# EasyEDA Pro project KeysDock.eprj, schematic z.controller-old
Board Name: controller; Create Date: 2025-10-22; Page Name: general; Project Name: KeysDock; Schematic Name: controller; Update Date: 2025-10-24; Company: KeysDock Dev; Drawed: Reverier-Xu; Page Size: A4; Version: V1.0
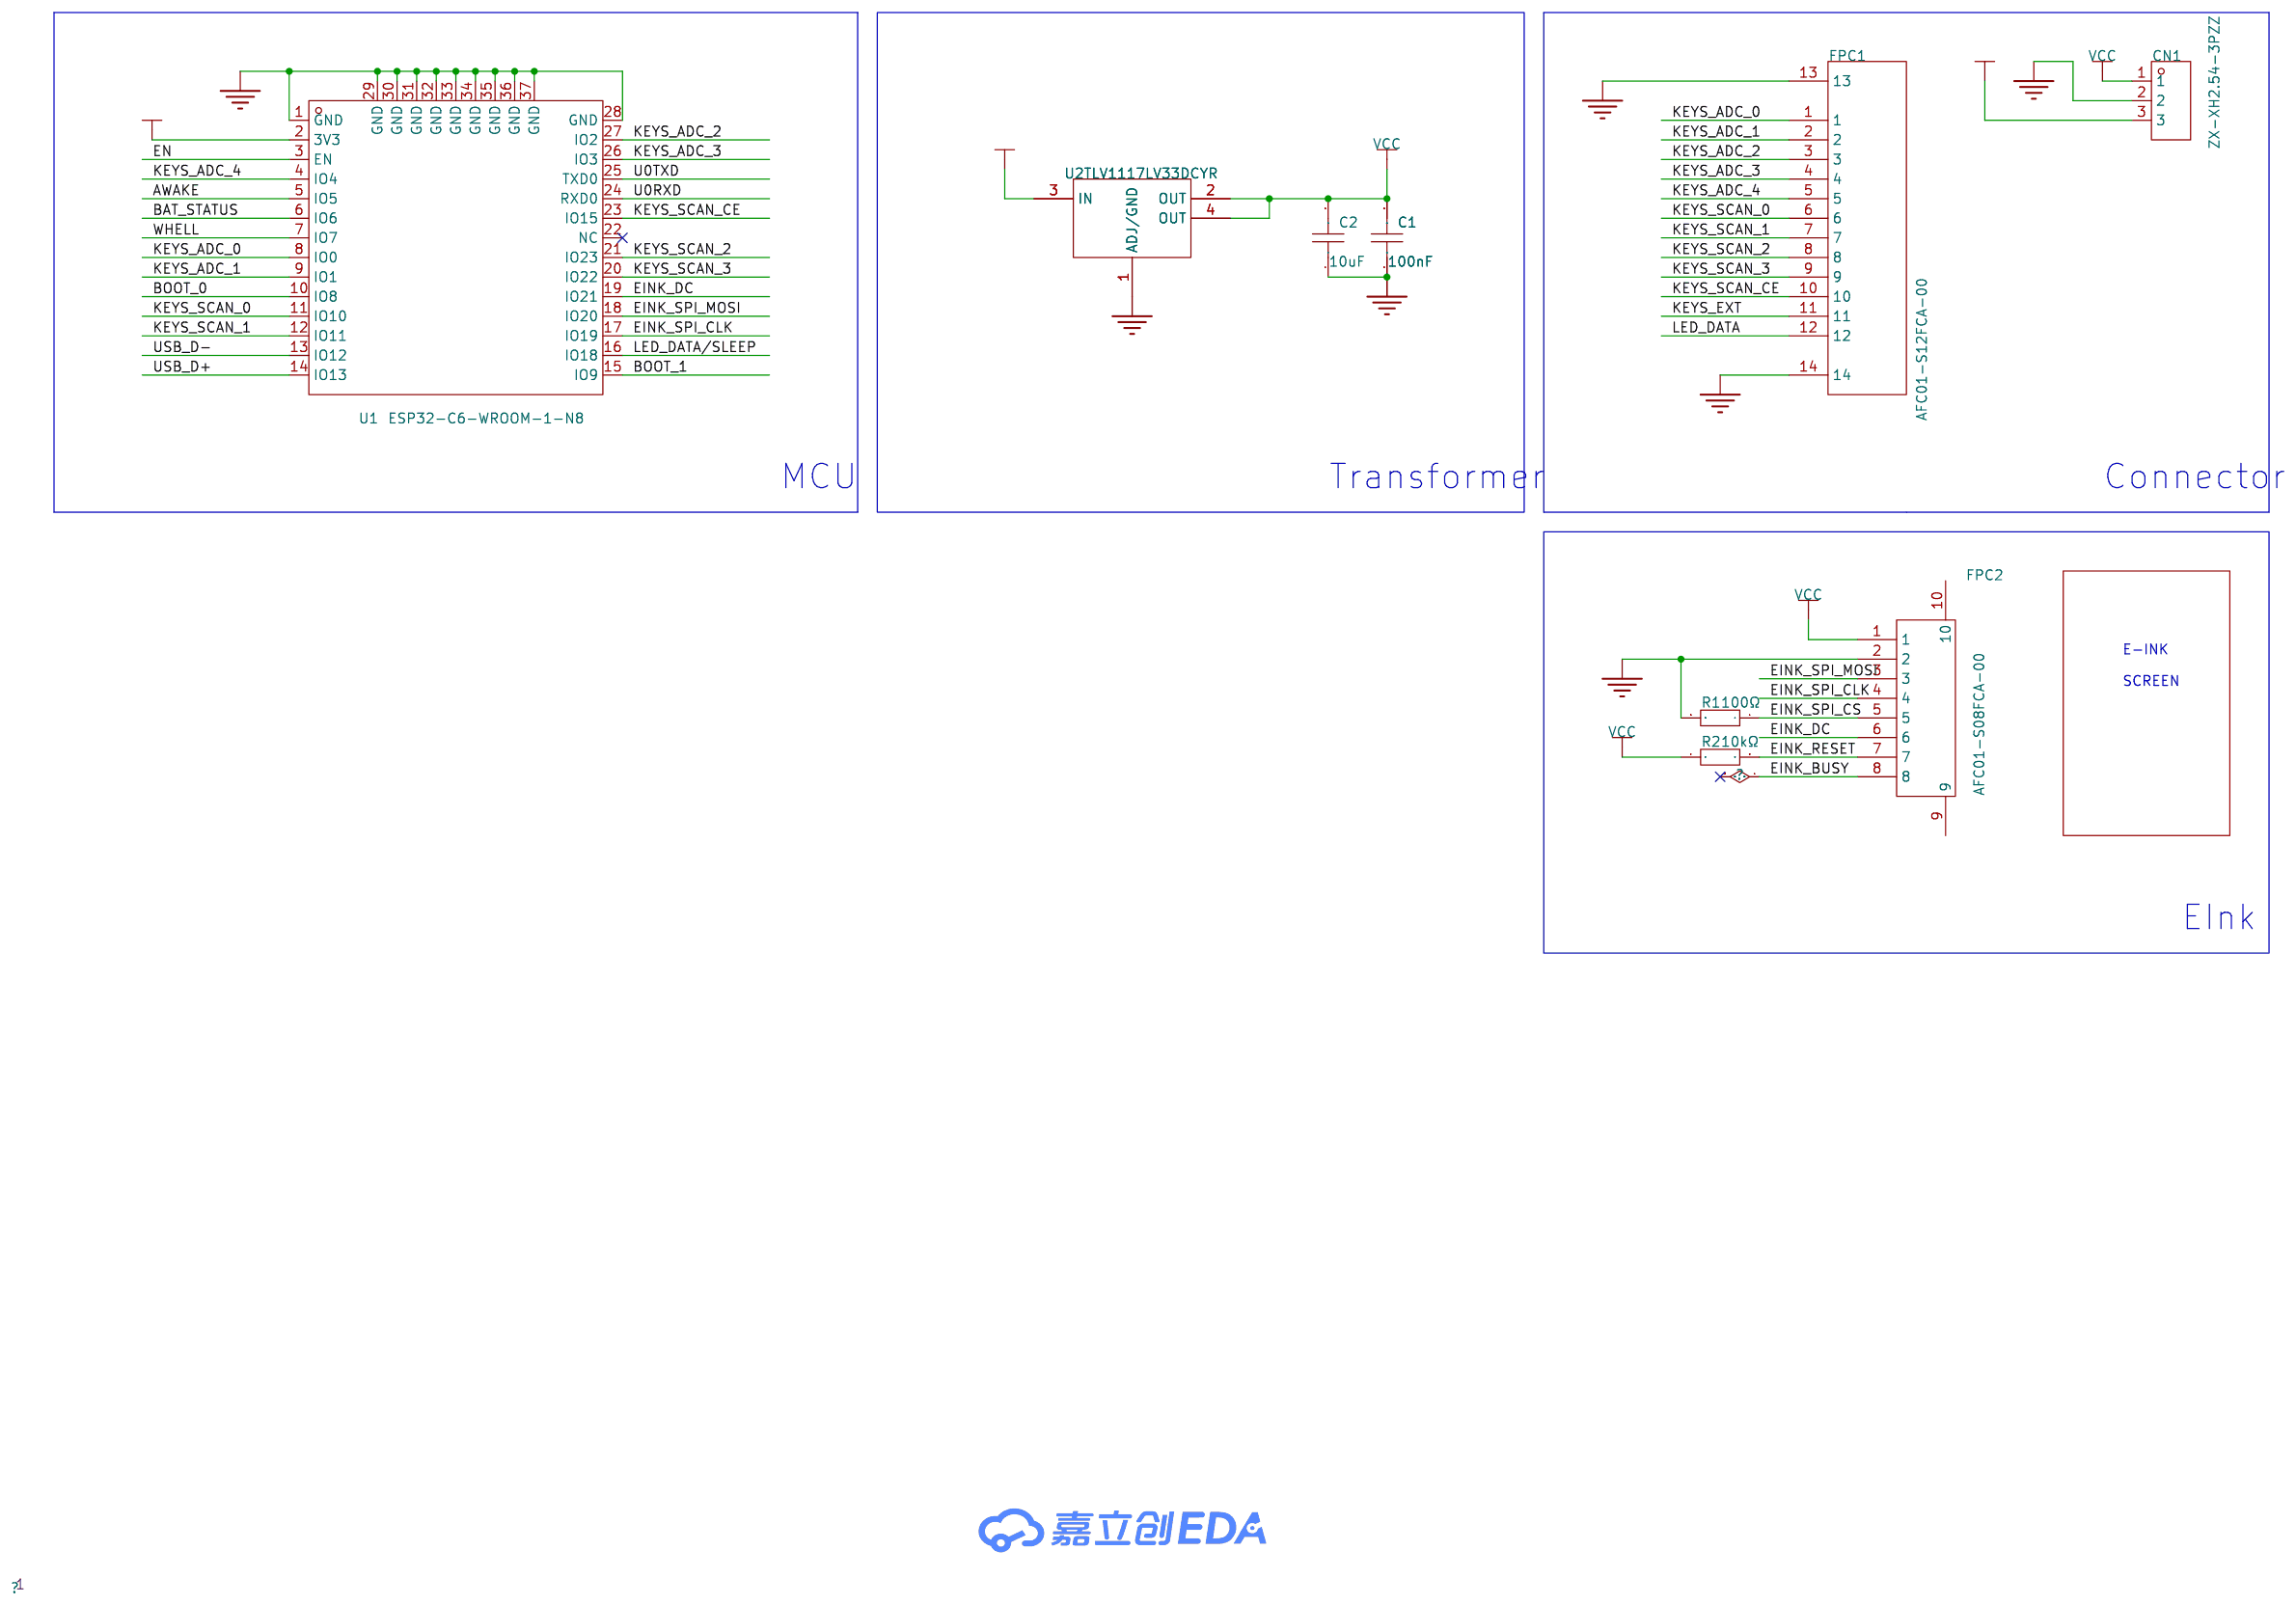
[diagram p8: schematic sheet]

## Parts
C1  100nF  [C0603]
C2  10uF  [C0603]
CN1  ZX-XH2.54-3PZZ  [CONN-TH_3P-P2.54_2501S-3P]
FPC1  AFC01-S12FCA-00  [FPC-SMD_AFC01-S12FCA-00]
FPC2  AFC01-S08FCA-00  [FPC-SMD_P0.50-8P_FGS-XJ-H2.0]
R1  100Ω  [R0402]
R2  10kΩ  [R0402]
U1  ESP32-C6-WROOM-1-N8  [WIRELM-SMD_ESP32-C6-WROOM-1]
U2  TLV1117LV33DCYR  [SOT-223_L6.7-W3.5-P2.30-BR]

## Library data of the parts
C1 C2 = CAP_0603: Supplier Footprint: 0603
CN1 = ZX-XH2.54-3PZZ: LCSC Part Name: 1x3P 间距:2.5mm 直插 系列:XH; Supplier Part: C7429633; Manufacturer: Megastar(兆星); Supplier Footprint: 插件,P=2.5mm; JLCPCB Part Class: 扩展库; Datasheet: https://item.szlcsc.com/datasheet/ZX-XH2.54-3PZZ/8427550.html; Supplier: LCSC; Pins Structure: 1x3P; Pitch: 2.5mm; Mounting Type: 直插; Reference Series: XH; Number of Pins: 3P; Number of Rows: 1; Number of PINs Per Row: 3; Current Rating: 3A; Contact Material: 黄铜; Contact Plating: 锡; Operating Temperature: -25℃~+85℃; Voltage Rating: 250V; Plastic Material: PA66; Flame Retardant Rating: UL94V-0; Color: 白色; Z-Height of the Board: 7mm; X-Length of Bottom Edge on Board (Spacing Line): 10mm; Y-Width of Bottom Edge on Board: 5.9mm
FPC1 = AFC01-S12FCA-00: LCSC Part Name: 间距:0.5mm P数:12P 翻盖式 下接; Supplier Part: C262661; Manufacturer: JS(钜硕电子); Supplier Footprint: SMD,P=0.5mm,卧贴; JLCPCB Part Class: 扩展库; Datasheet: https://item.szlcsc.com/datasheet/AFC01-S12FCA-00/253920.html; Supplier: LCSC; Locking Feature: 翻盖式; Contact Type: 下接; Number of Contacts: 12P; Pitch: 0.5mm; Mounting Type: 卧贴; FFC, FCB Thickness: 0.3mm; Height Above Board: 2mm
FPC2 = AFC01-S08FCA-00: LCSC Part Name: 间距:0.5mm P数:8P 翻盖式 下接; Supplier Part: C262657; Manufacturer: JS(钜硕电子); Supplier Footprint: SMD,P=0.5mm,卧贴; JLCPCB Part Class: 扩展库; Datasheet: https://item.szlcsc.com/datasheet/AFC01-S08FCA-00/253916.html; Supplier: LCSC; Locking Feature: 翻盖式; Contact Type: 下接; Number of Contacts: 8P; Pitch: 0.5mm; Mounting Type: 卧贴; FFC, FCB Thickness: 0.3mm; Height Above Board: 2mm
R1 = 0402WGF1000TCE: LCSC Part Name: 100Ω ±1% 62.5mW 厚膜电阻; Supplier Part: C25076; Manufacturer: UNI-ROYAL(厚声); Supplier Footprint: 0402; JLCPCB Part Class: Basic Part; Datasheet: https://atta.szlcsc.com/upload/public/pdf/source/20200306/C422600_1E6D84923E4A46A82E41ADD87F860B5C.pdf; Supplier: LCSC; Type: 厚膜电阻; Tolerance: ±1%; Power(Watts): 62.5mW; Overload Voltage (Max): 50V; Temperature Coefficient: ±200ppm/℃; Operating Temperature Range: -55℃~+155℃
R2 = 0402WGF1002TCE: LCSC Part Name: 10kΩ ±1% 62.5mW 厚膜电阻; Supplier Part: C25744; Manufacturer: UNI-ROYAL(厚声); Supplier Footprint: 0402; JLCPCB Part Class: Basic Part; Datasheet: https://item.szlcsc.com/datasheet/0402WGF1002TCE/26487.html; Supplier: LCSC; Type: 厚膜电阻; Tolerance: ±1%; Power(Watts): 62.5mW; Voltage-Supply(Max): 50V; Temperature Coefficient: ±100ppm/℃; Operating Temperature: -55℃~+155℃
U1 = ESP32-C6-WROOM-1-N8: Supplier Part: C5366877; Manufacturer: ESPRESSIF(乐鑫); JLCPCB Part Class: 扩展库; Datasheet: https://item.szlcsc.com/datasheet/ESP32-C6-WROOM-1-N8/6203223.html; Supplier: LCSC
U2 = TLV1117LV33DCYR: LCSC Part Name: 1A 低压降稳压器; Supplier Part: C15578; Manufacturer: TI(德州仪器); Supplier Footprint: SOT-223; JLCPCB Part Class: 扩展库; Datasheet: https://www.ti.com/cn/lit/gpn/tlv1117lv; Supplier: LCSC; Output Type: 固定; Maximum Input Voltage: 5.5V; Output Voltage: 3.3V; Output Current: 1A; Power Supply Rejection Ratio (PSRR): 75dB@(120Hz); Dropout Voltage: 1.3V@(800mA); standby current: 100uA; Feature: 防静电保护；低ESR；热保护(TSD)；过流保护(OCP)；欠压闭锁; Operating Temperature: -40℃~+125℃; Output Polarity: 正极; Number of Outputs: 1

## Nets
GND: C1.1 C2.1 CN1.2 FPC1.13 FPC1.14 FPC2.2 R1.2 U1.1(GND) U1.28(GND) U1.29(GND) U1.30(GND) U1.31(GND) U1.32(GND) U1.33(GND) U1.34(GND) U1.35(GND) U1.36(GND) U1.37(GND) U2.1(ADJ/GND)
VCC: C1.2 C2.2 CN1.1 FPC2.1 R2.1 U1.2(3V3) U2.2(OUT) U2.4(OUT)
VCC_BAT: CN1.3 U2.3(IN)
AWAKE: U1.5(IO5)
BAT_STATUS: U1.6(IO6)
BOOT_0: U1.10(IO8)
BOOT_1: U1.15(IO9)
EINK_BUSY: FPC2.8
EINK_DC: FPC2.6 U1.19(IO21)
EINK_RESET: FPC2.7 R2.2
EINK_SPI_CLK: FPC2.4 U1.17(IO19)
EINK_SPI_CS: FPC2.5 R1.1
EINK_SPI_MOSI: FPC2.3 U1.18(IO20)
EN: U1.3(EN)
KEYS_ADC_0: FPC1.1 U1.8(IO0)
KEYS_ADC_1: FPC1.2 U1.9(IO1)
KEYS_ADC_2: FPC1.3 U1.27(IO2)
KEYS_ADC_3: FPC1.4 U1.26(IO3)
KEYS_ADC_4: FPC1.5 U1.4(IO4)
KEYS_EXT: FPC1.11
KEYS_SCAN_0: FPC1.6 U1.11(IO10)
KEYS_SCAN_1: FPC1.7 U1.12(IO11)
KEYS_SCAN_2: FPC1.8 U1.21(IO23)
KEYS_SCAN_3: FPC1.9 U1.20(IO22)
KEYS_SCAN_CE: FPC1.10 U1.23(IO15)
LED_DATA: FPC1.12
LED_DATA/SLEEP: U1.16(IO18)
U0RXD: U1.24(RXD0)
U0TXD: U1.25(TXD0)
USB_D+: U1.14(IO13)
USB_D-: U1.13(IO12)
WHELL: U1.7(IO7)

Not connected (* = marked no-connect by the designer): FPC2 9 10; U1 22(NC)*

## Notes on the sheet
- MCU
- Transformer
- Connector
- E-INK
  SCREEN
- EInk
